# Altium schematic sheet PLD_RadFET.SchDoc: RadFET
size A4; SheetTotal: 32
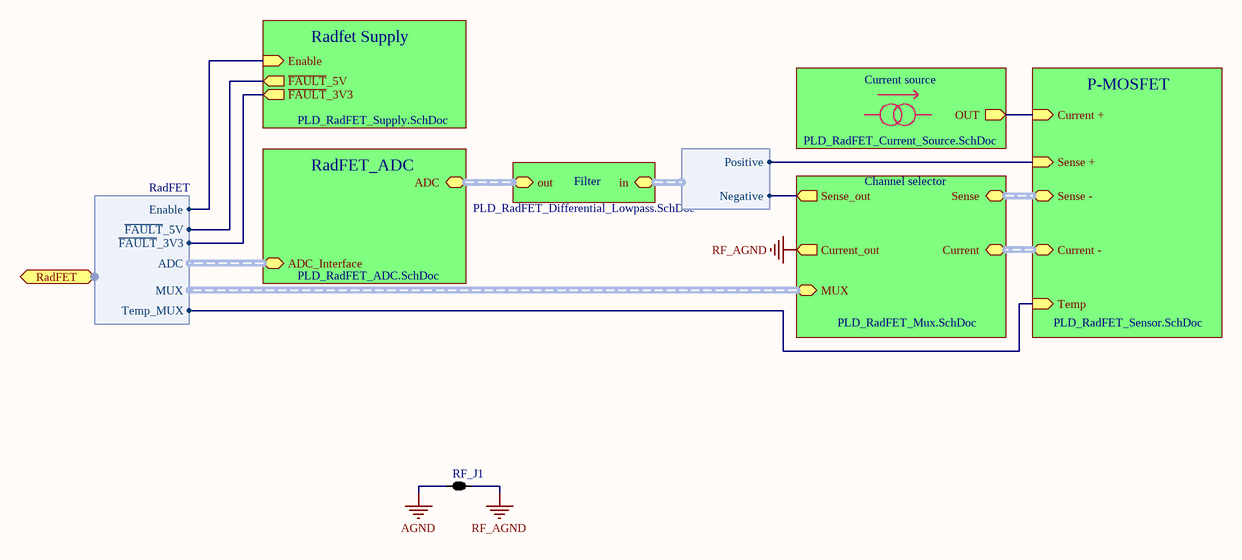
[diagram p0: PLD_RadFET.SchDoc]

## Parts
RF_J1  2 way net tie junction  [2way_LP]  (value not drawn)  (net tie, no BOM)

## Sub-sheets
Channel selector = PLD_RadFET_Mux.SchDoc: Sense_out (out), Sense (harness ADG709_MUX_CH), Current (harness ADG709_MUX_CH), MUX (harness ADG709_MUX), Current_out (out)
Current source = PLD_RadFET_Current_Source.SchDoc: OUT (out)
Filter = PLD_RadFET_Differential_Lowpass.SchDoc: in (harness ADC Channel), out (harness ADC Channel)
P-MOSFET = PLD_RadFET_Sensor.SchDoc: Sense + (in), Current + (in), Current - (harness ADG709_MUX_CH), Sense - (harness ADG709_MUX_CH), Temp (in)
Radfet Supply = PLD_RadFET_Supply.SchDoc: Enable (in), ~{FAULT}_5V (out), ~{FAULT}_3V3 (out)
RadFET_ADC = PLD_RadFET_ADC.SchDoc: ADC (harness ADC Channel), ADC_Interface (harness ADC_DIGITAL)

## Ports
RadFET (harness RadFET)

## Harnesses
RadFET: ADC, MUX, Enable, Temp_MUX, ~{FAULT}_5V, ~{FAULT}_3V3
ADC Channel: Positive, Negative

## Nets
AGND: RF_J1.1
RF_AGND: RF_J1.2 ; sheet Channel selector/Current_out
(unnamed): sheet Radfet Supply/Enable, port RadFET.Enable
(unnamed): sheet Radfet Supply/~{FAULT}_5V, port RadFET.~{FAULT}_5V
(unnamed): sheet Radfet Supply/~{FAULT}_3V3, port RadFET.~{FAULT}_3V3
(unnamed): sheet Current source/OUT, sheet P-MOSFET/Current +
(unnamed): sheet Channel selector/Sense_out, sheet Filter/in.Negative
(unnamed): sheet P-MOSFET/Sense +, sheet Filter/in.Positive
(unnamed): sheet P-MOSFET/Temp, port RadFET.Temp_MUX

## Buses and harness runs
harness sheet Channel selector/Current = sheet P-MOSFET/Current -
harness sheet Channel selector/Sense = sheet P-MOSFET/Sense -
harness sheet Filter/out = sheet RadFET_ADC/ADC

## Notes on the sheet
- Title:
- Project:
- Author:
- Model:
- Document Number:
- Checked by:
- Rev:
- Date:
- Approved by:
- Sheet:
- of
- File name:

## Library data of the parts
RF_J1 = 2way: ComponentLink1URL: http://www.edatools.cz/addons; ComponentLink1Description: Source; FootprintNote: LP=12mil, MP=40mil, HP=120mil